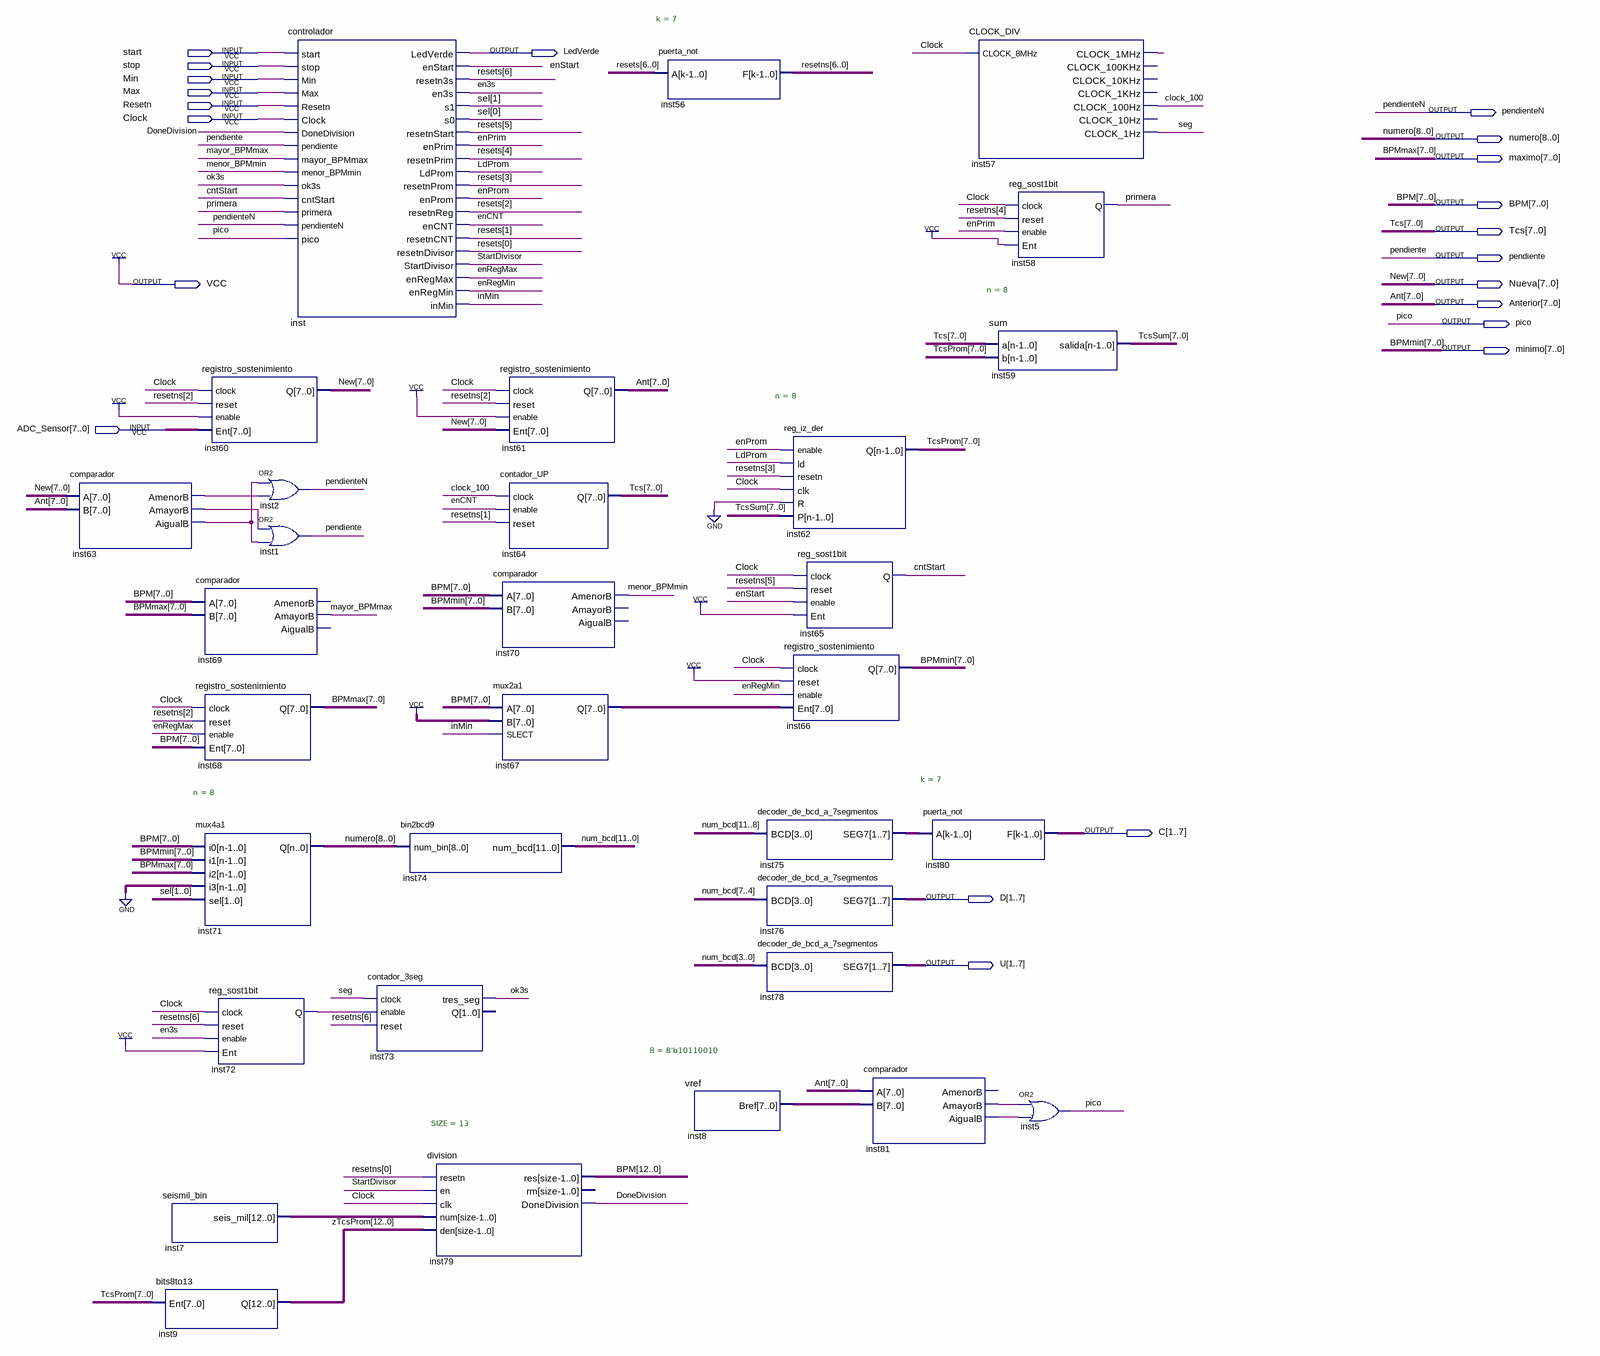
[diagram p0: schematic sheet]
// Quartus schematic bloques.bdf as structural Verilog: 32 symbols, 22 pins
module bloques (
  input  start,
  input  stop,
  input  Min,
  input  Max,
  input  Resetn,
  input  Clock,
  input  [7:0] ADC_Sensor,
  output LedVerde,
  output pendienteN,
  output [8:0] numero,
  output [7:0] maximo,
  output [12:0] BPM,
  output [7:0] Tcs,
  output pendiente,
  output VCC,
  output [7:0] Nueva,
  output [7:0] Anterior,
  output pico,
  output [7:0] minimo,
  output [1:7] C,
  output [1:7] D,
  output [1:7] U
);

  wire clock_100, cntStart, DoneDivision, en3s, enCNT, enPrim, enProm, enRegMax, enRegMin, enStart, inMin,
       inst57_clock_1mhz, inst63_aigualb, inst63_amayorb, inst63_amenorb, inst72_q, inst81_aigualb,
       inst81_amayorb, LdProm, mayor_BPMmax, menor_BPMmin, ok3s, primera, seg, StartDivisor;
  wire [1:0] sel;
  wire [6:0] inst75_seg7, resetns, resets;
  wire [7:0] inst8_bref, inst67_q, TcsProm, TcsSum;
  wire [11:0] num_bcd;
  wire [12:0] inst7_seis_mil, zTcsProm;

  comparador inst63 (
    .A(Nueva), .B(Anterior), .AmenorB(inst63_amenorb), .AmayorB(inst63_amayorb), .AigualB(inst63_aigualb));
  comparador inst69 (.A(BPM[7:0]), .B(maximo), .AmayorB(mayor_BPMmax));  // open: AmenorB, AigualB
  registro_sostenimiento inst68 (.clock(Clock), .reset(resetns[2]), .enable(enRegMax), .Ent(BPM[7:0]), .Q(maximo));
  mux4a1 #(.n(8)) inst71 (.i0(BPM[7:0]), .i1(minimo), .i2(maximo), .i3({8{1'b0}}), .sel(sel), .Q(numero));
  seismil_bin inst7 (.seis_mil(inst7_seis_mil));
  bits8to13 inst9 (.Ent(TcsProm), .Q(zTcsProm));
  registro_sostenimiento inst60 (.clock(Clock), .reset(resetns[2]), .enable(1'b1), .Ent(ADC_Sensor), .Q(Nueva));
  reg_sost1bit inst72 (.clock(Clock), .reset(resetns[6]), .enable(en3s), .Ent(1'b1), .Q(inst72_q));
  controlador inst (
    .start(start), .stop(stop), .Min(Min), .Max(Max), .Resetn(Resetn), .Clock(Clock),
    .DoneDivision(DoneDivision), .pendiente(pendiente), .mayor_BPMmax(mayor_BPMmax),
    .menor_BPMmin(menor_BPMmin), .ok3s(ok3s), .cntStart(cntStart), .primera(primera),
    .pendienteN(pendienteN), .pico(pico), .LedVerde(LedVerde), .enStart(enStart), .resetn3s(resets[6]),
    .en3s(en3s), .s1(sel[1]), .s0(sel[0]), .resetnStart(resets[5]), .enPrim(enPrim), .resetnPrim(resets[4]),
    .LdProm(LdProm), .resetnProm(resets[3]), .enProm(enProm), .resetnReg(resets[2]), .enCNT(enCNT),
    .resetnCNT(resets[1]), .resetnDivisor(resets[0]), .StartDivisor(StartDivisor), .enRegMax(enRegMax),
    .enRegMin(enRegMin), .inMin(inMin));
  or inst2 (pendienteN, inst63_aigualb, inst63_amenorb);
  or inst1 (pendiente, inst63_amayorb, inst63_aigualb);
  bin2bcd9 inst74 (.num_bin(numero), .num_bcd(num_bcd));
  contador_3seg inst73 (.clock(seg), .enable(inst72_q), .reset(resetns[6]), .tres_seg(ok3s));  // open: Q
  division #(.SIZE(13)) inst79 (
    .resetn(resetns[0]), .en(StartDivisor), .clk(Clock), .num(inst7_seis_mil), .den(zTcsProm), .res(BPM),
    .DoneDivision(DoneDivision));  // open: rm
  registro_sostenimiento inst61 (.clock(Clock), .reset(resetns[2]), .enable(1'b1), .Ent(Nueva), .Q(Anterior));
  contador_UP inst64 (.clock(clock_100), .enable(enCNT), .reset(resetns[1]), .Q(Tcs));
  comparador inst70 (.A(BPM[7:0]), .B(minimo), .AmenorB(menor_BPMmin));  // open: AmayorB, AigualB
  mux2a1 inst67 (.A(BPM[7:0]), .B({8{1'b1}}), .SLECT(inMin), .Q(inst67_q));
  puerta_not #(.k(7)) inst56 (.A(resets), .F(resetns));
  vref #(.B(8'b10110010)) inst8 (.Bref(inst8_bref));
  decoder_de_bcd_a_7segmentos inst75 (.BCD(num_bcd[11:8]), .SEG7(inst75_seg7));
  decoder_de_bcd_a_7segmentos inst76 (.BCD(num_bcd[7:4]), .SEG7(D));
  decoder_de_bcd_a_7segmentos inst78 (.BCD(num_bcd[3:0]), .SEG7(U));
  reg_iz_der #(.n(8)) inst62 (
    .enable(enProm), .ld(LdProm), .resetn(resetns[3]), .clk(Clock), .R(1'b0), .P(TcsSum), .Q(TcsProm));
  reg_sost1bit inst65 (.clock(Clock), .reset(resetns[5]), .enable(enStart), .Ent(1'b1), .Q(cntStart));
  registro_sostenimiento inst66 (.clock(Clock), .reset(1'b1), .enable(enRegMin), .Ent(inst67_q), .Q(minimo));
  comparador inst81 (
    .A(Anterior), .B(inst8_bref), .AmayorB(inst81_amayorb), .AigualB(inst81_aigualb));  // open: AmenorB
  puerta_not #(.k(7)) inst80 (.A(inst75_seg7), .F(C));
  CLOCK_DIV inst57 (
    .CLOCK_8MHz(Clock), .CLOCK_1MHz(inst57_clock_1mhz), .CLOCK_100Hz(clock_100), .CLOCK_1Hz(seg));  // open: CLOCK_100KHz, CLOCK_10KHz, CLOCK_1KHz, CLOCK_10Hz
  sum #(.n(8)) inst59 (.a(Tcs), .b(TcsProm), .salida(TcsSum));
  reg_sost1bit inst58 (.clock(Clock), .reset(resetns[4]), .enable(enPrim), .Ent(1'b1), .Q(primera));
  or inst5 (pico, inst81_amayorb, inst81_aigualb);

  assign VCC = 1'b1;

  // Other names for the same wires on the sheet: Ant[7:0] = Anterior; BPMmax[7:0] = maximo; BPMmin[7:0] = minimo;
  //   New[7:0] = Nueva
endmodule
